# EAGLE design REV002 (EAGLE 9.4.1)
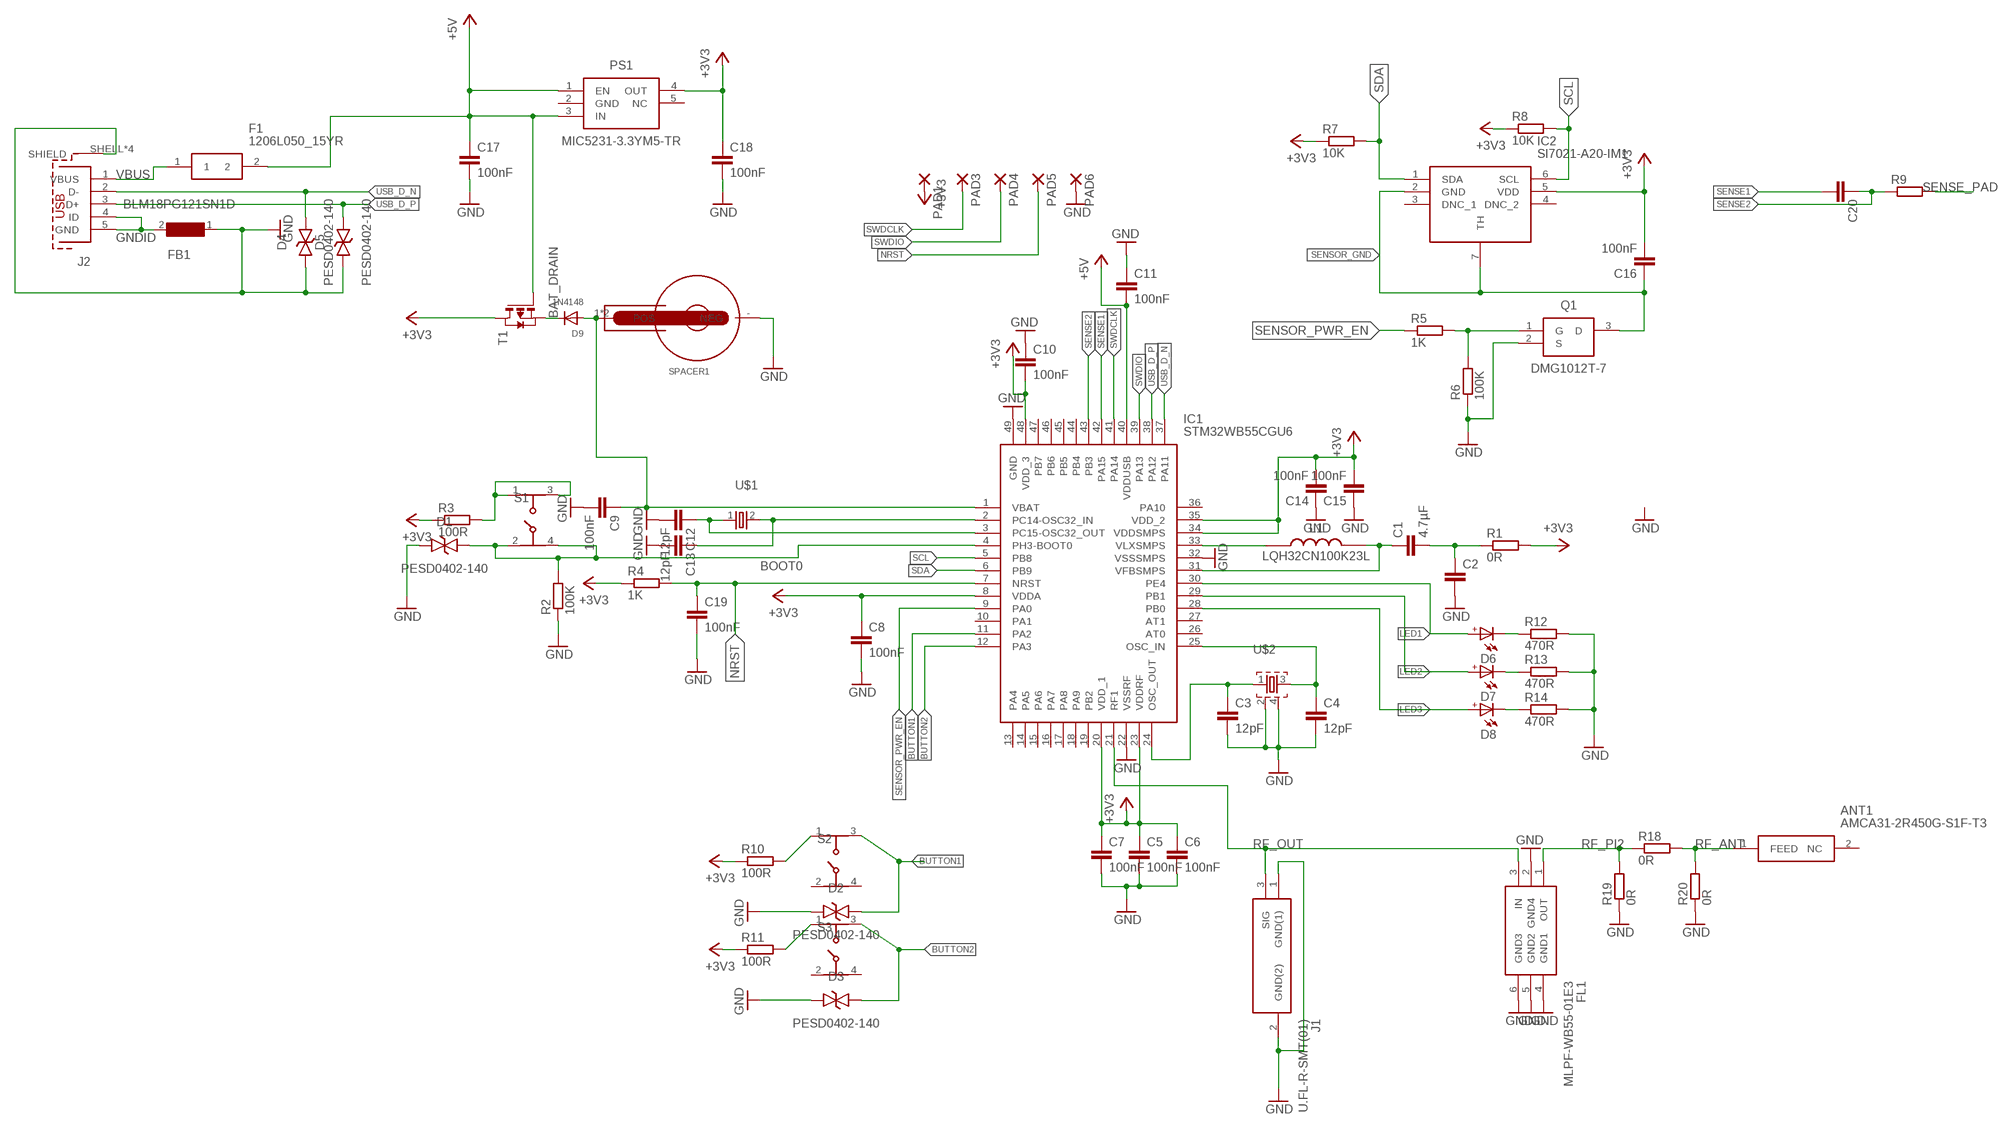
[diagram p0: schematic, sheet 1]

## Parts
ANT1  AMCA31-2R450G-S1F-T3  [ANTC3216X140N]
C1  4.7µF  C-EUC1210K  [C1210K]
C2  C-EUC0402K  [C0402K]
C3  12pF  C-EUC0402K  [C0402K]
C4  12pF  C-EUC0402K  [C0402K]
C5  100nF  C-EUC0402K  [C0402K]
C6  100nF  C-EUC0402K  [C0402K]
C7  100nF  C-EUC0402K  [C0402K]
C8  100nF  C-EUC0402K  [C0402K]
C9  100nF  C-EUC0402K  [C0402K]
C10  100nF  C-EUC0402K  [C0402K]
C11  100nF  C-EUC0402K  [C0402K]
C12  12pF  C-EUC0402K  [C0402K]
C13  12pF  C-EUC0402K  [C0402K]
C14  100nF  C-EUC0402K  [C0402K]
C15  100nF  C-EUC0402K  [C0402K]
C16  100nF  C-EUC0402K  [C0402K]
C17  100nF  C-EUC0402K  [C0402K]
C18  100nF  C-EUC0402K  [C0402K]
C19  100nF  C-EUC0402K  [C0402K]
C20  C-EUC0402K  [C0402K]
D1  PESD0402-140  [DIONC1005X43N]
D2  PESD0402-140  [DIONC1005X43N]
D3  PESD0402-140  [DIONC1005X43N]
D4  PESD0402-140  [DIONC1005X43N]
D5  PESD0402-140  [DIONC1005X43N]
D6  WL-SMCD_0603_150060BS55040  [WL-SMCD_0603]
D7  WL-SMCD_0603_150060BS55040  [WL-SMCD_0603]
D8  WL-SMCD_0603_150060BS55040  [WL-SMCD_0603]
D9  1N4148  DIODESOD-323F  [SOD-323F]
F1  1206L050_15YR  [FUSC3216X75N]
FB1  BLM18PG121SN1D  [BEADC1608X95N]
FL1  MLPF-WB55-01E3  [MLPFWB5501E3]
IC1  STM32WB55CGU6  [QFN50P700X700X65-49N]
IC2  SI7021-A20-IM1  [SON100P300X300X121-7N]
J1  U.FL-R-SMT(01)  [U.FL-R-SMT(01)]
J2  629105136821  [629105136821]
L1  LQH32CN100K23L  [INDPM3225X220N]
PAD1  SMD2  [SMD1,27-2,54]
PAD3  SMD2  [SMD1,27-2,54]
PAD4  SMD2  [SMD1,27-2,54]
PAD5  SMD2  [SMD1,27-2,54]
PAD6  SMD2  [SMD1,27-2,54]
PS1  MIC5231-3.3YM5-TR  [SOT95P270X145-5N]
Q1  DMG1012T-7  [SOT50P160X80-3N]
R1  0R  R-EU_R0402  [R0402]
R2  100K  R-EU_R0402  [R0402]
R3  100R  R-EU_R0402  [R0402]
R4  1K  R-EU_R0402  [R0402]
R5  1K  R-EU_R0402  [R0402]
R6  100K  R-EU_R0402  [R0402]
R7  10K  R-EU_R0402  [R0402]
R8  10K  R-EU_R0402  [R0402]
R9  R-EU_R0402  [R0402]
R10  100R  R-EU_R0402  [R0402]
R11  100R  R-EU_R0402  [R0402]
R12  470R  R-EU_R0402  [R0402]
R13  470R  R-EU_R0402  [R0402]
R14  470R  R-EU_R0402  [R0402]
R18  0R  R-EU_R0402  [R0402]
R19  0R  R-EU_R0402  [R0402]
R20  0R  R-EU_R0402  [R0402]
S1  434153017835  [434153017835]
S2  434153017835  [434153017835]
S3  434153017835  [434153017835]
SPACER1  WA-BCMC_SMT_79523141  [79523141]
T1  PMOSSOT23  [SOT-23]
U$1  XTAL_32KHZ  [XTAL_3215_N]
U$2  XTAL_32MHZ  [BT-XTAL_2016_N]

## Nets
+3V3: C5.1 C6.1 C7.1 C8.1 C10.2 C14.2 C15.2 C16.2 C18.1 IC1.8(VDDA) IC1.20(VDD_1) IC1.23(VDDRF) IC1.34(VDDSMPS) IC1.35(VDD_2) IC1.48(VDD_3) IC2.5(VDD) PAD1.1(P) PS1.4(OUT) R1.2 R3.1 R4.1 R7.1 R8.1 R10.1 R11.1 T1.1(D)
+5V: C11.2 C17.1 F1.2 IC1.40(VDDUSB) PS1.1(EN) PS1.3(IN) T1.3(G)
BAT+: C9.1 D9.A IC1.1(VBAT) SPACER1.1(POS) SPACER1.2(POS)
BAT_DRAIN: D9.C T1.2(S)
BOOT0: D1.2(A) IC1.4(PH3-BOOT0) R2.2 S1.2 S1.4
BOOT0_R: R3.2 S1.1 S1.3
BUTTON1: D2.2(A) IC1.11(PA2) S2.3
BUTTON1_R: R10.2 S2.1
BUTTON2: D3.2(A) IC1.12(PA3) S3.3
BUTTON2_R: R11.2 S3.1
GND: C2.2 C3.2 C4.2 C5.2 C6.2 C7.2 C8.2 C9.2 C10.1 C11.1 C12.2 C13.2 C14.1 C15.1 C17.2 C18.2 C19.2 D1.1(K) D2.1(K) D3.1(K) D4.1(K) D5.1(K) FB1.1 FL1.2(GND4) FL1.4(GND1) FL1.5(GND2) FL1.6(GND3) IC1.22(VSSRF) IC1.32(VSSSMPS) IC1.49(GND) J1.1(GND(1)) J1.2(GND(2)) J2.SHELL1(SHIELD) J2.SHELL2(SHIELD) J2.SHELL3(SHIELD) J2.SHELL(SHIELD) PAD6.1(P) Q1.2(S) R2.1 R6.1 R12.2 R13.2 R14.2 R19.1 R20.1 SPACER1.-(NEG) U$2.2 U$2.4
GNDID: FB1.2 J2.4(ID) J2.5(GND)
LED1: D6.2(A) IC1.30(PE4)
LED1_R: D6.1(C) R12.1
LED2: D7.2(A) IC1.29(PB1)
LED2_R: D7.1(C) R13.1
LED3: D8.2(A) IC1.28(PB0)
LED3_R: D8.1(C) R14.1
N$8: C13.1 IC1.2(PC14-OSC32_IN) U$1.2
N$9: C12.1 IC1.3(PC15-OSC32_OUT) U$1.1
NRST: C19.1 IC1.7(NRST) PAD5.1(P) R4.2
OSC_IN: C4.1 IC1.25(OSC_IN) U$2.3
OSC_OUT: C3.1 IC1.24(OSC_OUT) U$2.1
RF_ANT: ANT1.1(FEED) R18.2 R20.2
RF_OUT: FL1.3(IN) IC1.21(RF1) J1.3(SIG)
RF_PI2: FL1.1(OUT) R18.1 R19.2
SCL: IC1.5(PB8) IC2.6(SCL) R8.2
SDA: IC1.6(PB9) IC2.1(SDA) R7.2
SENSE1: C20.2 IC1.42(PA15)
SENSE2: C20.1 IC1.43(PB3) R9.1
SENSE_PAD: R9.2
SENSOR_GATE: Q1.1(G) R5.2 R6.2
SENSOR_GND: C16.1 IC2.2(GND) IC2.7(TH) Q1.3(D)
SENSOR_PWR_EN: IC1.9(PA0) R5.1
SMPS: C1.2 C2.1 R1.1
SWDCLK: IC1.41(PA14) PAD3.1(P)
SWDIO: IC1.39(PA13) PAD4.1(P)
USB_D_N: D4.2(A) IC1.37(PA11) J2.2(D-)
USB_D_P: D5.2(A) IC1.38(PA12) J2.3(D+)
VBUS: F1.1 J2.1(VBUS)
VFBSMPS: C1.1 IC1.31(VFBSMPS) L1.2
VLXSMPS: IC1.33(VLXSMPS) L1.1
Unconnected: ANT1.2(NC) IC1.10(PA1) IC1.13(PA4) IC1.14(PA5) IC1.15(PA6) IC1.16(PA7) IC1.17(PA8) IC1.18(PA9) IC1.19(PB2) IC1.26(AT0) IC1.27(AT1) IC1.36(PA10) IC1.44(PB4) IC1.45(PB5) IC1.46(PB6) IC1.47(PB7) IC2.3(DNC_1) IC2.4(DNC_2) PS1.2(GND) PS1.5(NC) S2.2 S2.4 S3.2 S3.4

## Library data of the parts
ANT1 = SamacSys_Parts:AMCA31-2R450G-S1F-T3: ABRACON - AMCA31-2R450G-S1F-T3 - ANTENNA, CHIP, 2.45GHZ, 50 OHM, 1206 Source: Datasheet <http://www.abracon.com/chip-antenna/AMCA31-2R450G-S1F-T.pdf>; ARROW_PART_NUMBER: AMCA31-2R450G-S1F-T3; ARROW_PRICE/STOCK: https://www.arrow.com/en/products/amca31-2r450g-s1f-t3/abracon; DESCRIPTION: ABRACON - AMCA31-2R450G-S1F-T3 - ANTENNA, CHIP, 2.45GHZ, 50 OHM, 1206; HEIGHT: 1.4mm; MANUFACTURER_NAME: ABRACON; MANUFACTURER_PART_NUMBER: AMCA31-2R450G-S1F-T3
C1-C20 = rcl:C-EU: CAPACITOR, European symbol; SPICEPREFIX: C
D1-D5 = SamacSys_Parts:PESD0402-140: TVS Diode Bi-Directional PESD0402-140 40V, SOD-923 2-Pin <https://componentsearchengine.com/Images/3/PESD0402-140.jpg> Source: Datasheet <http://www.te.com/commerce/DocumentDelivery/DDEController?Action=showdoc&DocId=Specification Or StandardSCD27440FpdfEnglishENG_SS_SCD27440_F.pdfRF1600-000.pdf>; DESCRIPTION: TVS Diode Bi-Directional PESD0402-140 40V, SOD-923 2-Pin; HEIGHT: 0.43mm; MANUFACTURER_NAME: TE CONNECTIVITY; MANUFACTURER_PART_NUMBER: PESD0402-140; RS_PART_NUMBER: 7192294; SUPPLIER_NAME: RS
D6-D8 = Wurth_Elektronik_Optoelectronics_rev18h:WL-SMCD_0603: WL-SMCD SMD Mono-color Chip LED Diffused Characteristics Industrial 0603 platform – 1.6 x 0.8 mm Wide viewing angle 140° Thin version: 0.4 mm Applications Office Automation Home appliances Industrial equipment Front panel backlighting Button backlighting LCD backlighting Navigation backlighting <http://katalog.we-online.de/media/images/v2/Family_WL-SMCD_0603_thin_0,4mm_150060xx55040.jpg> Details see: http://katalog.we-online.de/en/led/WL-SMCD?m Created By Yingchun Shan 2018-03-09 2018 (C) Wurth Elektronik
D9 = adafruit:DIODE: Diode SMADIODE - SMA Surface Mount Package 20V 1A Schottky Diode Digikey: 641-1014-6-ND DO-1N4148 - Through Hole Small Current Diode SOD-123 20V 1 A (.5mV Vf) Schottky Diode - Digikey: MBRX120TPMSCT-ND SOD-323 10V 570mA (.38mV Vf, 3ns) Schottky Diode - Digikey: ZLLS410CT-ND SOD-523 30V 30mA Schottky Diode (RB751S-40TE61) - Digikey: RB751S-40TE61CT-ND SOT23-R/W - SOT23 Package (R = Solder Paste/Reflow Ovens, W = Hand-Soldering) BAT54Film 40V 300mA - Digikey: 497-7162-1-ND
F1 = SamacSys_Parts:1206L050_15YR: Littelfuse 0.5A Resettable Surface Mount Fuse, 15V dc Source: Datasheet <https://m.littelfuse.com/~/media/electronics/datasheets/resettable_ptcs/littelfuse_ptc_1206l_datasheet.pdf.pdf>; DESCRIPTION: Littelfuse 0.5A Resettable Surface Mount Fuse, 15V dc; HEIGHT: 0.75mm; MANUFACTURER_NAME: LITTELFUSE; MANUFACTURER_PART_NUMBER: 1206L050/15YR; MOUSER_PART_NUMBER: 576-1206L050/15YR; MOUSER_PRICE-STOCK: https://www.mouser.com/Search/Refine.aspx?Keyword=576-1206L050%2F15YR; RS_PART_NUMBER: 1740347; RS_PRICE-STOCK: http://uk.rs-online.com/web/p/products/1740347
FB1 = SamacSys_Parts:BLM18PG121SN1D: Ferrite bead SMD 0603 120R 2A Murata Ferrite Bead (Chip Ferrite Bead), 1.6 x 0.8 x 0.8mm (0603), 120 impedance at 100 MHz <https://componentsearchengine.com/Images/1/BLM18PG121SN1D.jpg> Source: Datasheet <https://componentsearchengine.com/Datasheets/2/BLM18PG121SN1D.pdf>; DESCRIPTION: Ferrite bead SMD 0603 120R 2A Murata Ferrite Bead (Chip Ferrite Bead), 1.6 x 0.8 x 0.8mm (0603), 120 impedance at 100 MHz; HEIGHT: 0.95mm; MANUFACTURER_NAME: Murata Electronics; MANUFACTURER_PART_NUMBER: BLM18PG121SN1D; RS_PART_NUMBER: 7241380P; SUPPLIER_NAME: RS
FL1 = SamacSys_Parts:MLPF-WB55-01E3: RF Wireless Misc 2.4 GHz Low Pass Filter matched to STM32WB55 Source: Datasheet <https://www.st.com/resource/en/datasheet/mlpf-wb55-01e3.pdf>; DESCRIPTION: RF Wireless Misc 2.4 GHz Low Pass Filter matched to STM32WB55; HEIGHT: 0.7mm; MANUFACTURER_NAME: STMicroelectronics; MANUFACTURER_PART_NUMBER: MLPF-WB55-01E3; MOUSER_PART_NUMBER: 511-MLPF-WB55-01E3; MOUSER_PRICE-STOCK: https://www.mouser.com/Search/Refine.aspx?Keyword=511-MLPF-WB55-01E3
IC1 = SamacSys_Parts:STM32WB55CGU6: ARM Microcontrollers - MCU Ultra-low-power dual core Arm Cortex-M4 MCU 64 MHz, Cortex-M0 32MHz with 1 Mbyte Flash, BLE, 802.15.4, USB, LCD, AES-256 Source: Datasheet <https://www.st.com/en/microcontrollers/stm32wb55cg.html>; DESCRIPTION: ARM Microcontrollers - MCU Ultra-low-power dual core Arm Cortex-M4 MCU 64 MHz, Cortex-M0 32MHz with 1 Mbyte Flash, BLE, 802.15.4, USB, LCD, AES-256; HEIGHT: 0.65mm; MANUFACTURER_NAME: STMicroelectronics; MANUFACTURER_PART_NUMBER: STM32WB55CGU6; MOUSER_PART_NUMBER: 511-STM32WB55CGU6; MOUSER_PRICE-STOCK: https://www.mouser.com/Search/Refine.aspx?Keyword=511-STM32WB55CGU6
IC2 = SamacSys_Parts:SI7021-A20-IM1: Si7021 Dig RH Temp Sensor Filter Silicon Labs Si7021-A20-IM1 Temperature & Humidity Sensor, -40 +125 C, 6-Pin DFN Source: Datasheet <https://componentsearchengine.com/Datasheets/2/SI7021-A20-IM1.pdf>; DESCRIPTION: Si7021 Dig RH Temp Sensor Filter Silicon Labs Si7021-A20-IM1 Temperature & Humidity Sensor, -40 +125 C, 6-Pin DFN; HEIGHT: 1.21mm; MANUFACTURER_NAME: Silicon Labs; MANUFACTURER_PART_NUMBER: Si7021-A20-IM1; MOUSER_PART_NUMBER: 634-SI7021-A20-IM1; MOUSER_PRICE-STOCK: https://www.mouser.com/Search/Refine.aspx?Keyword=634-SI7021-A20-IM1; RS_PART_NUMBER: 8652325P; RS_PRICE-STOCK: http://uk.rs-online.com/web/p/products/8652325P
J1 = SamacSys_Parts:U.FL-R-SMT(01): Hirose Straight 50 Surface Mount UFL Connector, Receptacle, Solder Termination Source: Datasheet <https://www.hirose.com/product/en/download_file/key_name/U.FL-R-SMT-1(32)/category/Drawing (2D)/doc_file_id/37630/?file_category_id=6&item_id=03310472232&is_series=>; ARROW_PART_NUMBER: U.FL-R-SMT(01); ARROW_PRICE/STOCK: https://www.arrow.com/en/products/u.fl-r-smt-01/hirose-electric; DESCRIPTION: Hirose Straight 50 Surface Mount UFL Connector, Receptacle, Solder Termination; HEIGHT: mm; MANUFACTURER_NAME: Hirose; MANUFACTURER_PART_NUMBER: U.FL-R-SMT(01); RS_PART_NUMBER: 4812324; RS_PRICE/STOCK: http://uk.rs-online.com/web/p/products/4812324
J2 = Wurth_Elektronik_Electromechanic_Input-Output_Connectors_rev19a:629105136821: WR-COM SMT Horizontal 5 Contacts Micro USB Type B,5 pins=>Code : Con_I-O_COM_MicroUSB_629105136821 <http://katalog.we-online.de/media/images/eican/Con_I-O_COM_MicroUSB_629105136821_pf2.jpg> Details see: http://katalog.we-online.de/en/em/COM_MICRO_SMT_TYPE_B_HORIZONTAL/629105136821?m Created 2014-07-09, Karrer Zheng 2014 (C) Würth Elektronik
L1 = SamacSys_Parts:LQH32CN100K23L: Murata LQH32CN Series Wire-wound SMD Inductor 10 H 10% 300mA Idc <https://componentsearchengine.com/Images/3/LQH32CN100K23L.jpg> Source: Datasheet <http://psearch.en.murata.com/inductor/product/LQH32CN100K23#.pdf>; DESCRIPTION: Murata LQH32CN Series Wire-wound SMD Inductor 10 H 10% 300mA Idc; HEIGHT: 2.2mm; MANUFACTURER_NAME: Murata Electronics; MANUFACTURER_PART_NUMBER: LQH32CN100K23L; RS_PART_NUMBER: 4811882; SUPPLIER_NAME: RS
PAD1 PAD3-PAD6 = wirepad:SMD2: SMD PAD
PS1 = SamacSys_Parts:MIC5231-3.3YM5-TR: 3V3 LDO Regulator <https://componentsearchengine.com/Images/9/MIC5231-3.3YM5-TR.jpg> Source: Datasheet <http://ww1.microchip.com/downloads/en/DeviceDoc/mic5231.pdf>; DESCRIPTION: 3V3 LDO Regulator; HEIGHT: 1.45mm; MANUFACTURER_NAME: Microchip; MANUFACTURER_PART_NUMBER: MIC5231-3.3YM5-TR
Q1 = SamacSys_Parts:DMG1012T-7: MOSFET N-Channel 20V 0.63A SOT523 Diodes Inc DMG1012T-7 N-channel MOSFET Transistor, 0.63 A, 20 V, 3-Pin SOT-523 <https://componentsearchengine.com/Images/3/DMG1012T-7.jpg> Source: Datasheet <https://www.diodes.com/assets/Datasheets/ds31783.pdf>; DESCRIPTION: MOSFET N-Channel 20V 0.63A SOT523 Diodes Inc DMG1012T-7 N-channel MOSFET Transistor, 0.63 A, 20 V, 3-Pin SOT-523; HEIGHT: 0.8mm; MANUFACTURER_NAME: Diodes Inc.; MANUFACTURER_PART_NUMBER: DMG1012T-7; RS_PART_NUMBER: 7514064; SUPPLIER_NAME: RS
R1-R14 R18-R20 = rcl:R-EU_: RESISTOR, European symbol; SPICEPREFIX: R
S1-S3 = Wurth_Elektronik_Electromechanic_Switch_rev18c:434153017835: WS-TASV Tact Switch J-Bend SMD version Specification Rating : 50mA, 12VDC Contact Resistance Initial: 100mΩ max. After life test:1mΩ max. Insulation Resistance: min.100MΩ at 500VDC Dielectric Strength : 250VAC for 1 minute Stroke:0.15±0.1mm Bounce :10ms max. Material Cover : : Stainless steel Stem :LCP UL 94 V-0. FramePA46 UL HB, color Black >Contact : Stainless Steel with Silver Tape:Polyimide tape Terminal : Copper Alloy with Silver <http://katalog.we-online.de/media/images/v2/WS-TASU_434331013822_a_4C.jpg> Details see: http://katalog.we-online.de/em/datasheet/434153017835.pdf 2015 (C) W��rth Elektronik
SPACER1 = Eagle_CABLE_HOLDERS_MOUNTING_TABS_BATTERY_HOLDER (rev16b):WA-BCMC: Battery Holder WA-BCMC Characteristics Material : Phosphor Bronze Surface:Nichel Comliance:Lead free and RoHs Packaging unit is 500 <http://katalog.we-online.de/media/images/v2/Family_WA-BCMC_Battery_Holder_795xxxxx.jpg> Details see: http://katalog.we-online.de/en/em/BCMC_BATTERY_HOLDER/79523141 2015 (C) Wurth Elektronik
T1 = zetex:PMOSSOT23: MOS FET; OC_FARNELL: unknown; OC_NEWARK: unknown
U$1 = Nordic_nRF:XTAL_32KHZ
U$2 = Nordic_nRF:XTAL_32MHZ

## Board
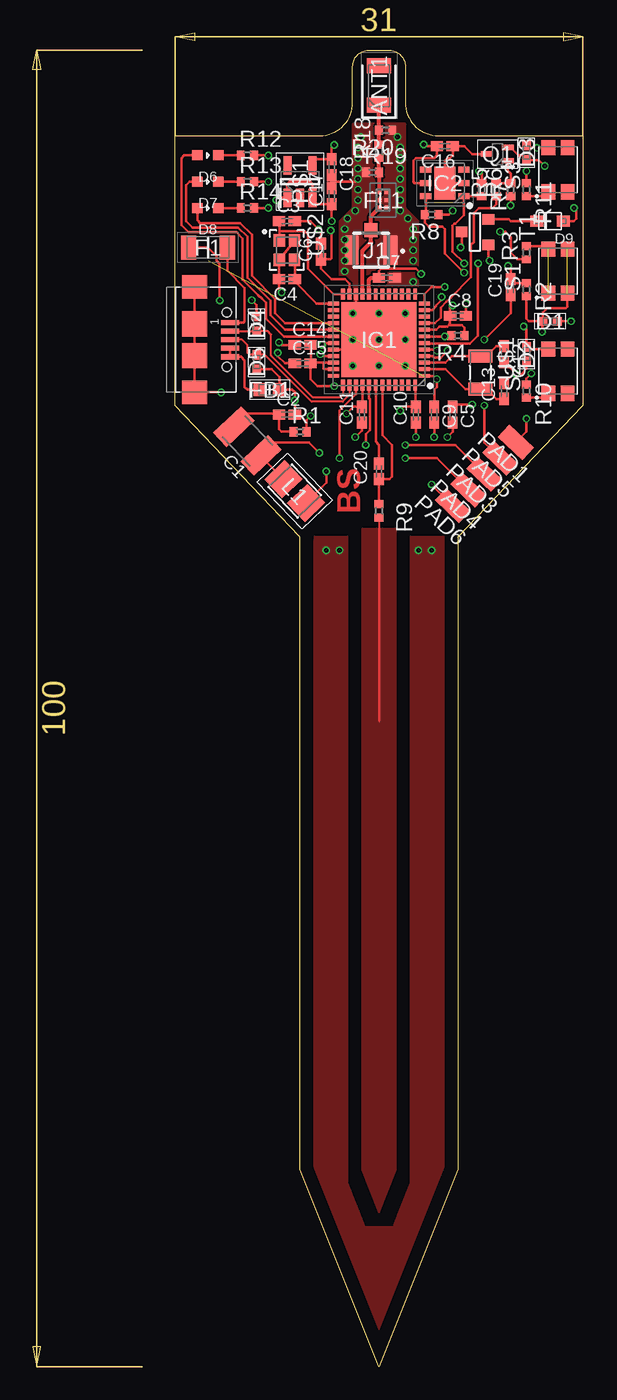
[diagram p1: board, top side]
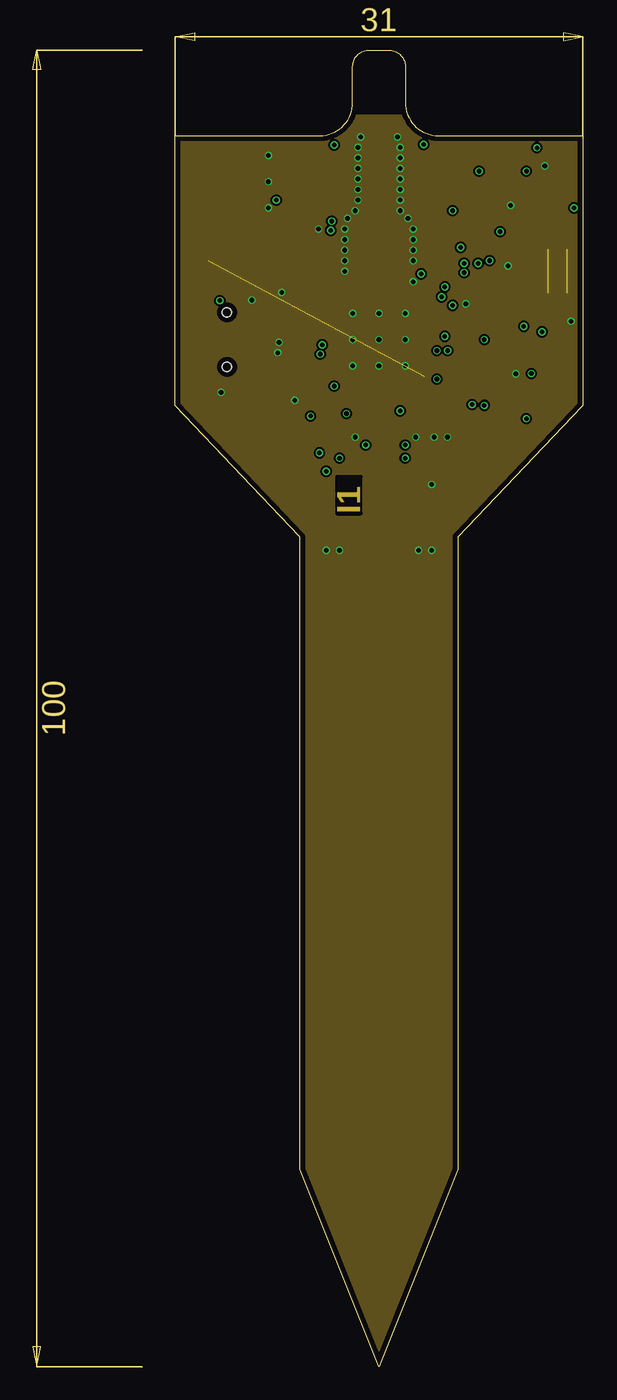
[diagram p2: board, inner layer GND]
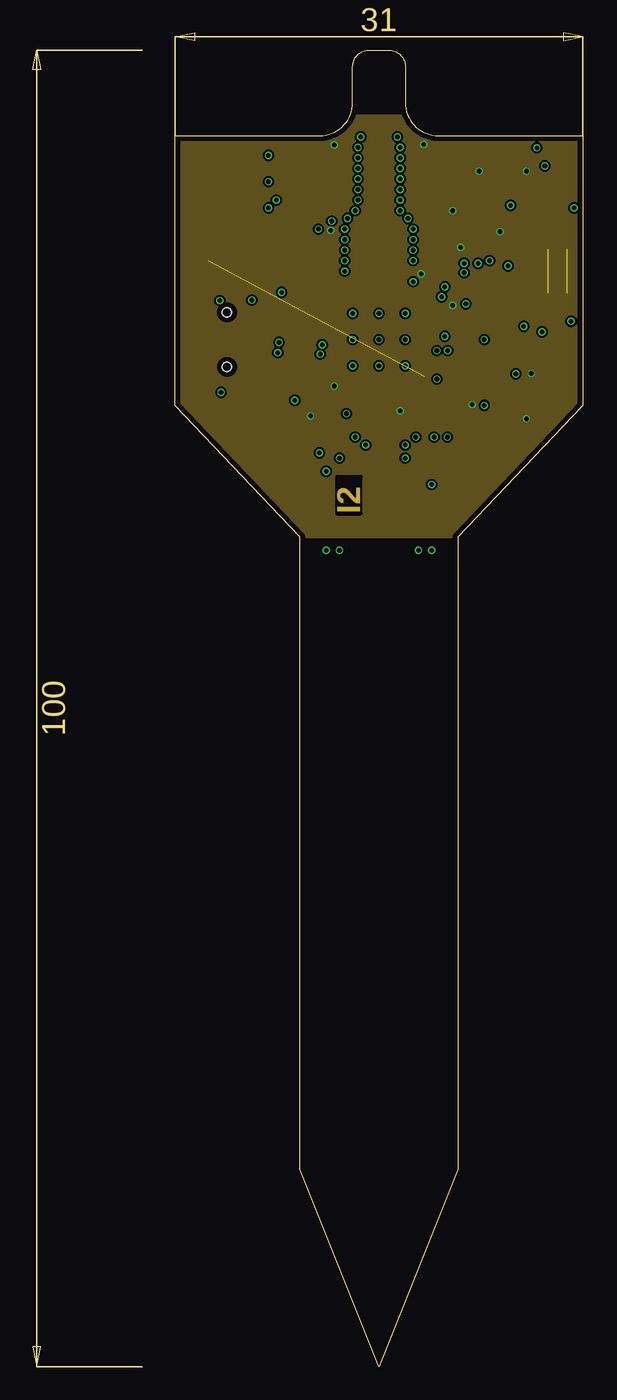
[diagram p3: board, inner layer SUPPLY]
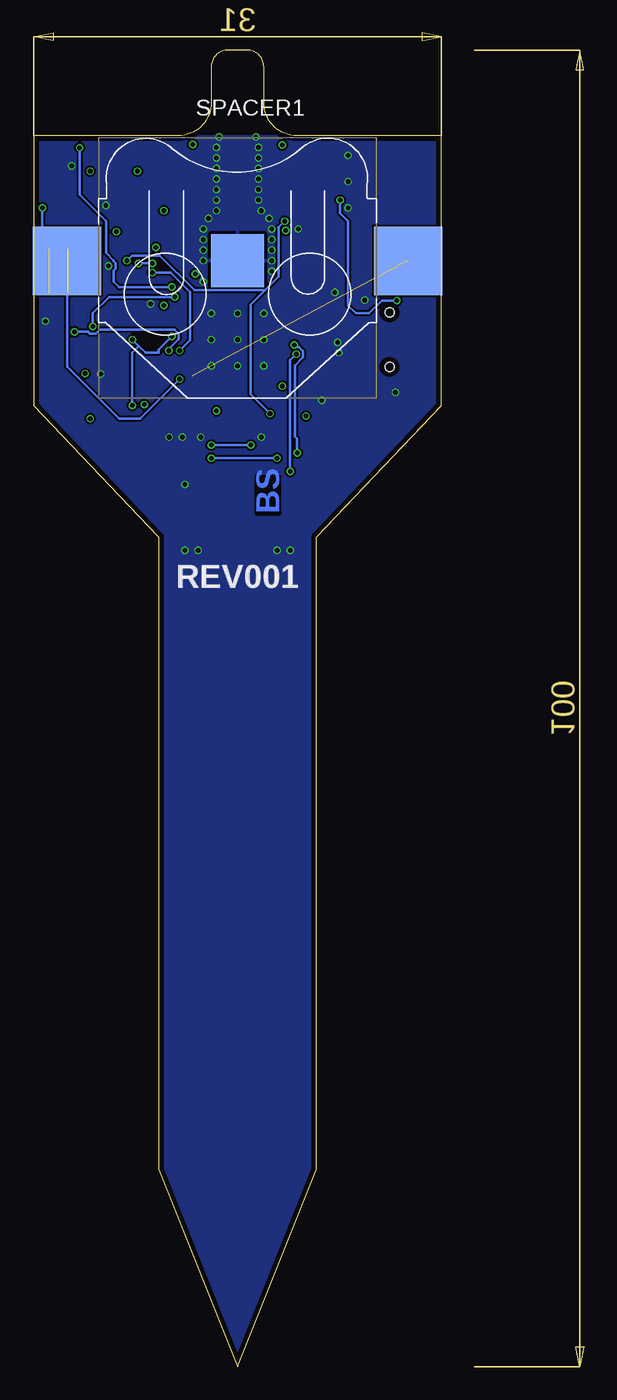
[diagram p4: board, bottom side, seen from below]

Size 31 x 100 mm. Coordinates in mm from the lower left corner, seen from the top.
Outline: 31,93.5 31,73 21.5,63 21.5,15 15.5,0 9.5,15 9.5,63 0,73 0,93.5 11,93.5 arc90 13.5,96 13.5,98.73 arc-90 14.77,100 16.23,100 arc-90 17.5,98.73 17.5,96 arc90 20,93.5 31,93.5
Copper layers (1*2*15*16): Top 0.035mm / dielectric 0.2mm / GND 0.0175mm / dielectric 0.3mm / SUPPLY 0.0175mm / dielectric 0.2mm / Bottom 0.035mm
Design rules "seeed-studio-4-layer": minimum track width 6mil, minimum drill 0.3mm, track to track 6mil, track to pad 6mil, pad to pad 6mil, via to via 6mil, smd to smd 0mil, copper to edge 0.4mm, drill to drill 10mil, minimum pad ring 6mil, minimum via ring 4mil, stop-mask expansion 4mil, vias tented up to drill 100mil, thermal gap 10mil

### Footprints (pad centres in the part's own frame; a part is rotated, then mirrored left to right if it is on the bottom)
ANTC3216X140N = smd 1.15 x 1.8: 1 -1.5,0; 2 1.5,0
C1210K = smd 1.5 x 2.9: 1 -1.5,0; 2 1.5,0
C0402K = smd 0.925 x 0.74: 1 -0.6,0; 2 0.6,0
DIONC1005X43N = smd 0.7 x 0.65: 1 -0.55,0; 2 0.55,0
WL-SMCD_0603 = smd 0.8 x 0.75: 1 -0.8,0; 2 0.8,0
SOD-323F = smd 1 x 0.8: A -1,0; C 1,0
FUSC3216X75N = smd 1.16 x 1.82: 1 -1.475,0; 2 1.475,0
BEADC1608X95N = smd 1 x 1: 1 -0.75,0; 2 0.75,0
MLPFWB5501E3 = smd 0.3 x 0.3: 1 -0.25,0.587; 2 -0.25,0; 3 -0.25,-0.587; 4 0.25,-0.587; 5 0.25,0; 6 0.25,0.587
QFN50P700X700X65-49N = smd 0.85 x 0.3: 1 -3.45,2.75; 2 -3.45,2.25; 3 -3.45,1.75; 4 -3.45,1.25; 5 -3.45,0.75; 6 -3.45,0.25; 7 -3.45,-0.25; 8 -3.45,-0.75; 9 -3.45,-1.25; 10 -3.45,-1.75; 11 -3.45,-2.25; 12 -3.45,-2.75; 25 3.45,-2.75; 26 3.45,-2.25; 27 3.45,-1.75; 28 3.45,-1.25; 29 3.45,-0.75; 30 3.45,-0.25; 31 3.45,0.25; 32 3.45,0.75; 33 3.45,1.25; 34 3.45,1.75; 35 3.45,2.25; 36 3.45,2.75 | smd 0.3 x 0.85: 13 -2.75,-3.45; 14 -2.25,-3.45; 15 -1.75,-3.45; 16 -1.25,-3.45; 17 -0.75,-3.45; 18 -0.25,-3.45; 19 0.25,-3.45; 20 0.75,-3.45; 21 1.25,-3.45; 22 1.75,-3.45; 23 2.25,-3.45; 24 2.75,-3.45; 37 2.75,3.45; 38 2.25,3.45; 39 1.75,3.45; 40 1.25,3.45; 41 0.75,3.45; 42 0.25,3.45; 43 -0.25,3.45; 44 -0.75,3.45; 45 -1.25,3.45; 46 -1.75,3.45; 47 -2.25,3.45; 48 -2.75,3.45 | smd 5.7 x 5.7: 49 0,0
SON100P300X300X121-7N = smd 0.85 x 0.45: 1 -1.45,1; 2 -1.45,0; 3 -1.45,-1; 4 1.45,-1; 5 1.45,0; 6 1.45,1 | smd 1.6 x 2.5: 7 0,0
U.FL-R-SMT(01) = smd 1.05 x 2.2: 1 -1.475,0; 2 1.475,0 | smd 1 x 1.05: 3 0,-1.525
629105136821 = smd 0.4 x 1.35: 1 -1.3,2.675; 2 -0.65,2.675; 3 0,2.675; 4 0.65,2.675; 5 1.3,2.675 | smd 1.8 x 1.9: SHELL -4,0; SHELL3 4,0 | smd 1.9 x 1.9: SHELL1 -1.2,0; SHELL2 1.2,0 | hole 0.7: -2.075,2.45; 2.075,2.45
INDPM3225X220N = smd 1.95 x 2.1: 1 -1.25,0; 2 1.25,0
SMD1,27-2,54 = smd 1.27 x 2.54: 1 0,0
SOT95P270X145-5N = smd 1.4 x 0.6: 1 -1.25,0.95; 2 -1.25,0; 3 -1.25,-0.95; 4 1.25,-0.95; 5 1.25,0.95
SOT50P160X80-3N = smd 0.9 x 0.4: 1 -0.8,0.5; 2 -0.8,-0.5; 3 0.8,0
R0402 = smd 0.6 x 0.7: 1 -0.5,0; 2 0.5,0
434153017835 = smd 1.15 x 1.05: 1 -1.675,0.725; 2 -1.675,-0.725; 3 1.675,0.725; 4 1.675,-0.725
79523141 = smd 5.2 x 5.2: 1 -12.95,0; 2 12.95,0 | smd 4 x 4: - 0,0
SOT-23 = smd 0.787 x 0.889: 1 0.025,-1.016; 2 -0.94,1.016; 3 0.991,1.016
XTAL_3215_N = smd 1 x 1.8: 1 -1.25,0; 2 1.25,0
BT-XTAL_2016_N = smd 0.95 x 0.85: 1 -0.725,-0.575; 2 0.725,-0.575; 3 0.725,0.575; 4 -0.725,0.575

### Placement (x,y rotation side)
ANT1  15.5,97.3 90 top
C1  5.5,70.3 133.5 top
C2  8.5,72.3 0 top
C3  8.5,87 0 top
C4  8.5,82.6 180 top
C5  21.1,72.3 270 top
C6  11.1,84.7 90 top
C7  16.1,82.7 0 top
C8  21.5,79.8 0 top
C9  19.7,72.3 270 top
C10  18.3,72.3 90 top
C11  14.2,72.3 90 top
C12  25,76.9 270 top
C13  25,74.1 90 top
C14  9.7,77.6 0 top
C15  9.7,76.2 0 top
C16  20.5,92.7 180 top
C17  11.9,88.9 90 top
C18  11.9,91.1 270 top
C19  25.5,82 90 top
C20  15.5,68 90 top
D1  28.5,79.4 180 top
D2  26.7,76.9 90 top
D3  26.7,92.2 90 top
D4  6.2,79.2 270 top
D5  6.2,76.3 90 top
D6  2.5,92 180 top
D7  2.5,90 180 top
D8  2.5,88 180 top
D9  28.5,87 180 top
F1  2.5,85 180 top
FB1  7.2,74.2 180 top
FL1  15.8,88.6 0 top
IC1  15.5,78 180 top
IC2  20.5,89.9 180 top
J1  14.9,84.8 180 top
J2  1.5,78 270 top
L1  9.1,66.5 133.5 top
PAD1  25.9,70.2 46.5 top
PAD3  23.5,67.8 46.5 top
PAD4  22.3,66.6 46.5 top
PAD5  24.7,69 46.5 top
PAD6  21.1,65.4 46.5 top
PS1  9.5,90 90 top
Q1  24.5,92.1 180 top
R1  9.5,71 0 top
R2  26.7,81.8 270 top
R3  26.7,84.6 90 top
R4  21.5,78.3 180 top
R5  24.4,89.4 90 top
R6  25.5,89.4 90 top
R7  23.3,89.4 270 top
R8  19.5,87.5 180 top
R9  15.5,65 270 top
R10  26.7,74.1 270 top
R11  26.7,89.4 270 top
R12  5.5,92 0 top
R13  5.5,90 0 top
R14  5.5,88 0 top
R18  15.5,92.3 90 top
R19  15,90.7 0 top
R20  16,93.9 180 top
S1  29.1,83.2 90 top
S2  29.1,75.6 90 top
S3  29.1,90.9 90 top
SPACER1  15.5,84 0 bottom
T1  22.8,86.2 270 top
U$1  23.2,75.5 270 top
U$2  8.5,84.8 270 top

### Tracks (layer width: path | path; a pad name or v marks a point on that pad's centre or on a via)
+3V3  (via drill 0.35)
  Top 0.2: IC1.23 13.25,82.25 12.9,82.6 11.9,82.6 11.1,83.4 C6.1 11.8,84.1 11.9,84.2 11.9,86.24 v11.84,86.29 | C7.1 15.5,83.2 15.7,83.4 18.3,83.4 v18.7,83 | R7.1 23.3,90.6 v23.1,90.8 | R11.1 v26.7,90.8 | v18.9,92.82 19.02,92.7 C16.2 19.9,92 19.7,91.8 18.3,91.8 18.1,91.6 18.1,90 18.2,89.9 IC2.5 | IC1.8 19.85,78.75 20.1,79 20.7,79 20.8,79.1 | 20.8,79.1 20.9,79.2 C8.1 20.9,80.4 v21.1,80.6 | R4.1 22,78.9 21.8,79.1 20.8,79.1 | R8.1 20.8,87.5 v21.1,87.8 | T1.1 21.78,85.08 v21.7,85 | IC1.48 18.25,72.95 C10.2 17.4,72.9 v17.1,72.6 | PAD1.1 26.7,71 v26.7,72 | PS1.4 10.45,91.7 C18.1 11.9,92.6 v12.1,92.8 | IC1.34 11.3,76.25 | 11.3,76.25 10.35,76.25 | 10.35,76.25 C15.2 10.3,75 10.83,74.47 v12.1,74.47 | IC1.35 11.35,75.75 11.3,75.8 11.3,76.25 | R1.2 10,71.9 v10.3,72.2 | R10.1 26.7,75.05 v27.07,75.43 | R3.1 26,84.1 25.5,84.6 25.5,85.8 25.1,86.2 v24.7,86.2 | C5.1 21.27,73.07 v22.57,73.07 | C14.2 10.35,77.55 10.35,76.25
  Top 0.305: IC1.20 14.75,82.55 14.9,82.7 C7.1
  pour SUPPLY: 12.5,97 -3.5,97 -3.5,92 -3.5,63 34.5,63 34.5,97 18.5,97 18.5,95 12.5,95
+5V  (via drill 0.35)
  Top 0.2: IC1.40 14.25,72.95 C11.2 13.54,72.9 v13.03,72.39 | 8.5,88.8 8.5,89.8 8.7,90 10.3,90 10.45,89.85 PS1.3 10.45,88.3 C17.1 v11.9,87 | 8.5,88.8 PS1.1 | v23.9,84 23.82,84.08 T1.3 | F1.2 2.5,85 3.14,84.36 3.14,83.98 3.39,83.73 v3.39,80.97 | v7.7,88.6 7.9,88.8 8.5,88.8
  Bottom 0.2: v11.9,87 12.37,86.53 12.37,82.77 13.39,81.75 | v23.9,84 23.5,84.4 21.4,84.4 18.75,81.75 13.39,81.75 | v3.39,80.97 4.53,80.97 5.5,80 6.5,80 7.1,80.6 7.1,87 7.7,87.6 v7.7,88.6 | 13.39,81.75 14.5,80.64 14.5,73.86 v13.03,72.39
BAT+  (via drill 0.35)  (1 unrouted)
  Top 0.2: IC1.1 19.65,75.25 v19.9,75 19.9,74.4 19.7,74.2 C9.1 | v30.32,88 30.5,87.82 30.5,87.2 30.3,87 D9.A
  Bottom 0.2: v30.32,88 30.32,85.87 SPACER1.1 28.45,75.95 24.5,72 22.9,72 v19.9,75 | 2.5,83.95 SPACER1.2
BAT_DRAIN
  Top 0.2: T1.2 25.36,87.14 25.5,87 D9.C
BOOT0  (via drill 0.35)  (1 unrouted)
  Top 0.2: S1.2 29.82,80.53 29.7,80.4 28.3,80.4 27.95,80.05 D1.2 27.9,79.4 | R2.2 26.7,79.6 26.9,79.4 27.9,79.4 | IC1.4 19.57,76.75 19.68,76.64 20.19,76.64 v20.72,77.17 | v27.9,78.6 27.9,79.4
  Bottom 0.2: v27.9,78.6 26.85,78.6 26.72,78.47 26.28,78.47 25.97,78.78 20.28,78.78 19.97,78.47 19.97,78.03 20.72,77.28 v20.72,77.17
BOOT0_R  (1 unrouted)
  Top 0.2: S1.3 28.15,85.1 R3.2
BUTTON1  (via drill 0.35)
  Top 0.2: S2.3 26.88,77.28 D2.2 26.7,78.8 v26.5,79 | IC1.11 19.55,80.25 19.83,80.53 19.83,80.58 20.25,81 v20.25,81.25
  Bottom 0.2: v26.5,79 26.5,80 25.25,81.25 v20.25,81.25
BUTTON1_R
  Top 0.2: S2.1 28.05,73.6 R10.2
BUTTON2  (via drill 0.35)
  Top 0.2: S3.3 v27.5,92.58 26.88,92.58 D3.2 | IC1.12 18.95,81.45 19.5,82 v20.5,82
  Bottom 0.2: v20.5,82 24.5,82 24.9,82.4 24.9,83.25 24.77,83.38 24.77,83.82 24.9,83.95 24.9,84 25.5,84.6 25.5,87 27.5,89 v27.5,92.58
BUTTON2_R
  Top 0.2: S3.1 28.05,88.9 R11.2
GND  (via drill 0.35)
  Top 0.2: D5.1 7.35,75.75 7.95,75.15 FB1.1 8.9,74.2 9.1,74 v9.1,73.4 C2.2 | Q1.2 25.5,92.6 26.1,92 26.35,92 D3.1 27.65,91.65 v28.1,91.2 | v25.3,83.6 25.5,83.4 C19.2 25.8,82.3 R2.1 | D1.1 v30.1,79.4 | R6.1 v25.5,88.2 | C13.2 25.7,75.4 | 25.7,75.4 v25.9,75.4 26.3,75.4 26.7,75.8 D2.1 | C12.2 25.7,75.6 25.7,75.4 | PAD6.1 v19.5,67 | R14.2 v7.1,88 | R13.2 v7.1,90 | R12.2 v7.1,92 | C17.2 11.9,90 | 11.9,90 C18.2 | v13.9,90.2 13.7,90 11.9,90 | C10.1 v18.3,70.6 | C9.2 v19.7,70.6 | C5.2 21.1,71 v20.7,70.6 | C11.1 14.2,71.1 v13.7,70.6 | C6.2 11.1,86.2 v10.9,86.4 10.3,87 C3.2 | v8.1,81.6 7.9,81.8 C4.2 7.9,84.05 U$2.2 U$2.4 | D4.1 6.2,80.63 v5.83,81 | C8.2 v22.1,80.72 | C15.1 8.37,76.2 7.8,76.76 v7.8,77.01 | C14.1 8.1,77.6 v7.9,77.8 | v3.5,74 J2.SHELL3 J2.SHELL2 J2.SHELL1 J2.SHELL | IC1.32 14.75,77.25 IC1.49 | IC1.22 13.75,80.25 v13.5,80
  other vias: 12.9,83.2 12.9,84 12.9,84.8 12.9,85.6 12.9,86.4 13.1,87.2 13.7,87.8 13.9,88.6 13.9,89.4 13.9,91 13.9,91.8 13.9,92.6 17.1,92.6 17.1,91.8 17.1,91 17.1,90.2 17.1,89.4 17.1,88.6 17.1,87.8 17.7,87.2 18.1,86.4 18.1,85.6 18.1,84.8 18.1,84 18.1,82.4 14.1,93.4 16.9,93.4 15.5,78 13.5,78 15.5,80 17.5,80 17.5,78 17.5,76 15.5,76 13.5,76 11.5,62 19.5,62 12.5,62 18.5,62
  pour Top (isolate 1.016, rank 2): 9.5,63 9.5,15 15.5,0 21.5,15 21.5,63
  pour Top (no thermals): 13.5,94.4 13.5,88 12.5,87 12.5,81 18.5,81 18.5,87 17.5,88 17.5,94.4
  pour Bottom: 0,93.5 0,73 9.5,63 9.5,15 15.5,0 21.5,15 21.5,63 31,73 31,93.5
  pour GND: 12.5,95 -1.5,95 -1.5,-3 32.5,-3 32.5,95
GNDID
  Top 0.152: 4.18,77 4.18,76.75 4.29,76.75 4.44,76.6
  Top 0.2: FB1.2 5.5,74.2 5.3,74.4 5.3,76.4 5,76.7 J2.5 4.18,77 J2.4
LED1
  Top 0.2: D6.2 0.7,92 0.5,91.8 0.5,86.7 1.04,86.16 4.66,86.16 5.15,85.67 5.15,82.55 6.3,81.4 6.6,81.1 6.9,80.8 6.9,79.6 8.28,78.22 12.02,78.22 IC1.30
LED1_R
  Top 0.2: D6.1 R12.1
LED2
  Top 0.2: IC1.29 8.5,78.75 8.4,78.75 8.36,78.75 7.25,79.85 7.25,80.95 5.5,82.7 5.5,85.82 4.81,86.52 1.34,86.52 0.85,87 0.85,89.75 1.1,90 D7.2
LED2_R
  Top 0.2: D7.1 R13.1
LED3
  Top 0.2: D8.2 1.7,87.07 1.9,86.87 4.95,86.87 5.85,85.97 5.85,82.84 7.61,81.09 7.61,80 8.36,79.25 IC1.28
LED3_R
  Top 0.2: D8.1 R14.1
N$8
  Top 0.2: IC1.2 20.55,75.75 22.05,74.25 U$1.2 23.65,74.25 24.4,73.5 C13.1
N$9
  Top 0.2: IC1.3 20.55,76.25 21.05,76.75 U$1.1 23.65,76.75 24.4,77.5 C12.1
NRST  (via drill 0.35)
  Top 0.2: IC1.7 v20.5,78.25 20.95,78.25 R4.2 | C19.1 25.5,80 v23.5,78 | v23.5,73 23.5,70.2 PAD5.1
  Bottom 0.2: v20.5,78.25 21.5,77.25 21.5,77 22.5,77 23,77.5 | v23.5,78 23,77.5 | v23.5,73 23.5,77 23,77.5
OSC_IN
  Top 0.2: C4.1 9.07,82.62 | C4.1 9.1,82.4 10.75,80.75 IC1.25 | C4.1 9.1,84.05 U$2.3
OSC_OUT
  Top 0.2: U$2.1 7.92,86.25 | 7.92,86.25 7.92,86.97 C3.1 | IC1.24 12.05,81.45 10.1,83.4 10.1,86 9.85,86.25 7.92,86.25
RF_ANT
  Top 0.305: R18.2 R20.2 ANT1.1
RF_OUT
  Top 0.305: IC1.21 14.25,83.57 14.25,84.75 14.9,85.4 J1.3 14.9,87.36 FL1.3
RF_PI2
  Top 0.305: FL1.1 15.55,90.65 R19.2 R18.1
SCL  (via drill 0.35)
  Top 0.2: IC2.6 19.05,87.55 R8.2 19,86.9 19.3,86.6 20.3,86.6 20.5,86.4 20.5,84.52 21.75,83.27 21.79,83.27 v21.97,83.09 | IC1.5 19.82,77.25 v19.9,77.17
  Bottom 0.2: v19.9,77.17 19.1,77.97 19.1,81.6 20.59,83.09 v21.97,83.09
SDA  (via drill 0.35)
  Top 0.2: R7.2 IC2.1 21.95,87.45 21.32,86.82 21.23,86.82 21.09,86.67 21.09,84.68 v21.97,83.8 | v23.03,83.8 23.03,78.32 22.41,77.7 19,77.7 IC1.6
  Bottom 0.2: v21.97,83.8 v23.03,83.8
SENSE1
  Top 0.2: IC1.42 15.25,70.25 15.5,70 C20.2
SENSE2
  Top 0.2: IC1.43 15.75,70.75 16.5,70 16.5,67.6 16.3,67.4 C20.1 R9.1
SENSE_PAD
  Top 0.152: R9.2 15.5,49
  pour Top (no thermals): 14.2,63.6 14.2,15 15.5,11.7 16.8,15 16.8,63.6
SENSOR_GATE
  Top 0.2: Q1.1 25.3,90.8 25.5,90.6 R6.2 R5.2
SENSOR_GND
  Top 0.2: Q1.3 22.6,92.1 22,92.7 C16.1 21.1,92 20.9,91.8 20.7,91.8 20.5,91.6 IC2.7 IC2.2
SENSOR_PWR_EN
  Top 0.2: IC1.9 19.75,79.25 20.18,79.69 20.18,80.43 20.63,80.87 20.95,81.2 22.5,82.75 22.5,85.2 22.7,85.4 22.7,87.6 23.1,88 24.1,88 24.4,88.3 R5.1
SMPS
  Top 0.2: C1.2 5.48,72.4 7.8,72.4 C2.1 7.9,71.2 8.1,71 R1.1
SWDCLK  (via drill 0.35)
  Top 0.2: PAD3.1 21.3,70 v17.5,70 | v14.5,70 14.5,70.81 14.82,71.13 14.82,73.47 14.75,73.54 IC1.41
  Bottom 0.2: v17.5,70 v14.5,70
SWDIO  (via drill 0.35)
  Top 0.2: PAD4.1 19.9,69 v17.5,69 | IC1.39 13.75,73.86 12.5,72.61 v12.5,69
  Bottom 0.2: v17.5,69 v12.5,69
USB_D_N
  Top 0.152: IC1.37 12.75,73.82 12.53,73.6 10.5,73.6 7.3,76.8 7.3,78.4 7.05,78.65 D4.2 J2.2
USB_D_P
  Top 0.152: IC1.38 13.25,73.82 12.72,73.3 10.37,73.3 6.82,76.85 D5.2 5.65,76.85 5.5,77 5.5,77.6 5.1,78 J2.3
VBUS
  Top 0.2: J2.1 5.2,79.3 5.3,79.4 5.3,81.9 3.97,83.23 F1.1
VFBSMPS  (via drill 0.35)
  Top 0.2: L1.2 6.53,69.11 C1.1 7.52,70.2 10.17,70.2 v10.97,69.4 | v11.19,77.61 11.34,77.75 IC1.31
  Bottom 0.2: v10.97,69.4 10.97,70.47 11.15,70.65 11.15,76.04 10.51,76.68 10.51,77.12 10.82,77.43 11.02,77.43 v11.19,77.61
VLXSMPS  (via drill 0.35)
  Top 0.2: IC1.33 11.19,76.75 v11.04,76.9 | v11.5,68 11.5,67.13 L1.1
  Bottom 0.2: v11.04,76.9 11.5,76.44 v11.5,68

### Text on the board
Top: BS
GND: I1
SUPPLY: I2
Bottom: BS
bPlace: REV001
tDruck: BTN1 | BOOT | USB | BTN2 | STM32WB55 Plant Sensor | pk.electronics 2019